# EAGLE design esp_garden_v2 (EAGLE 8.0.1)
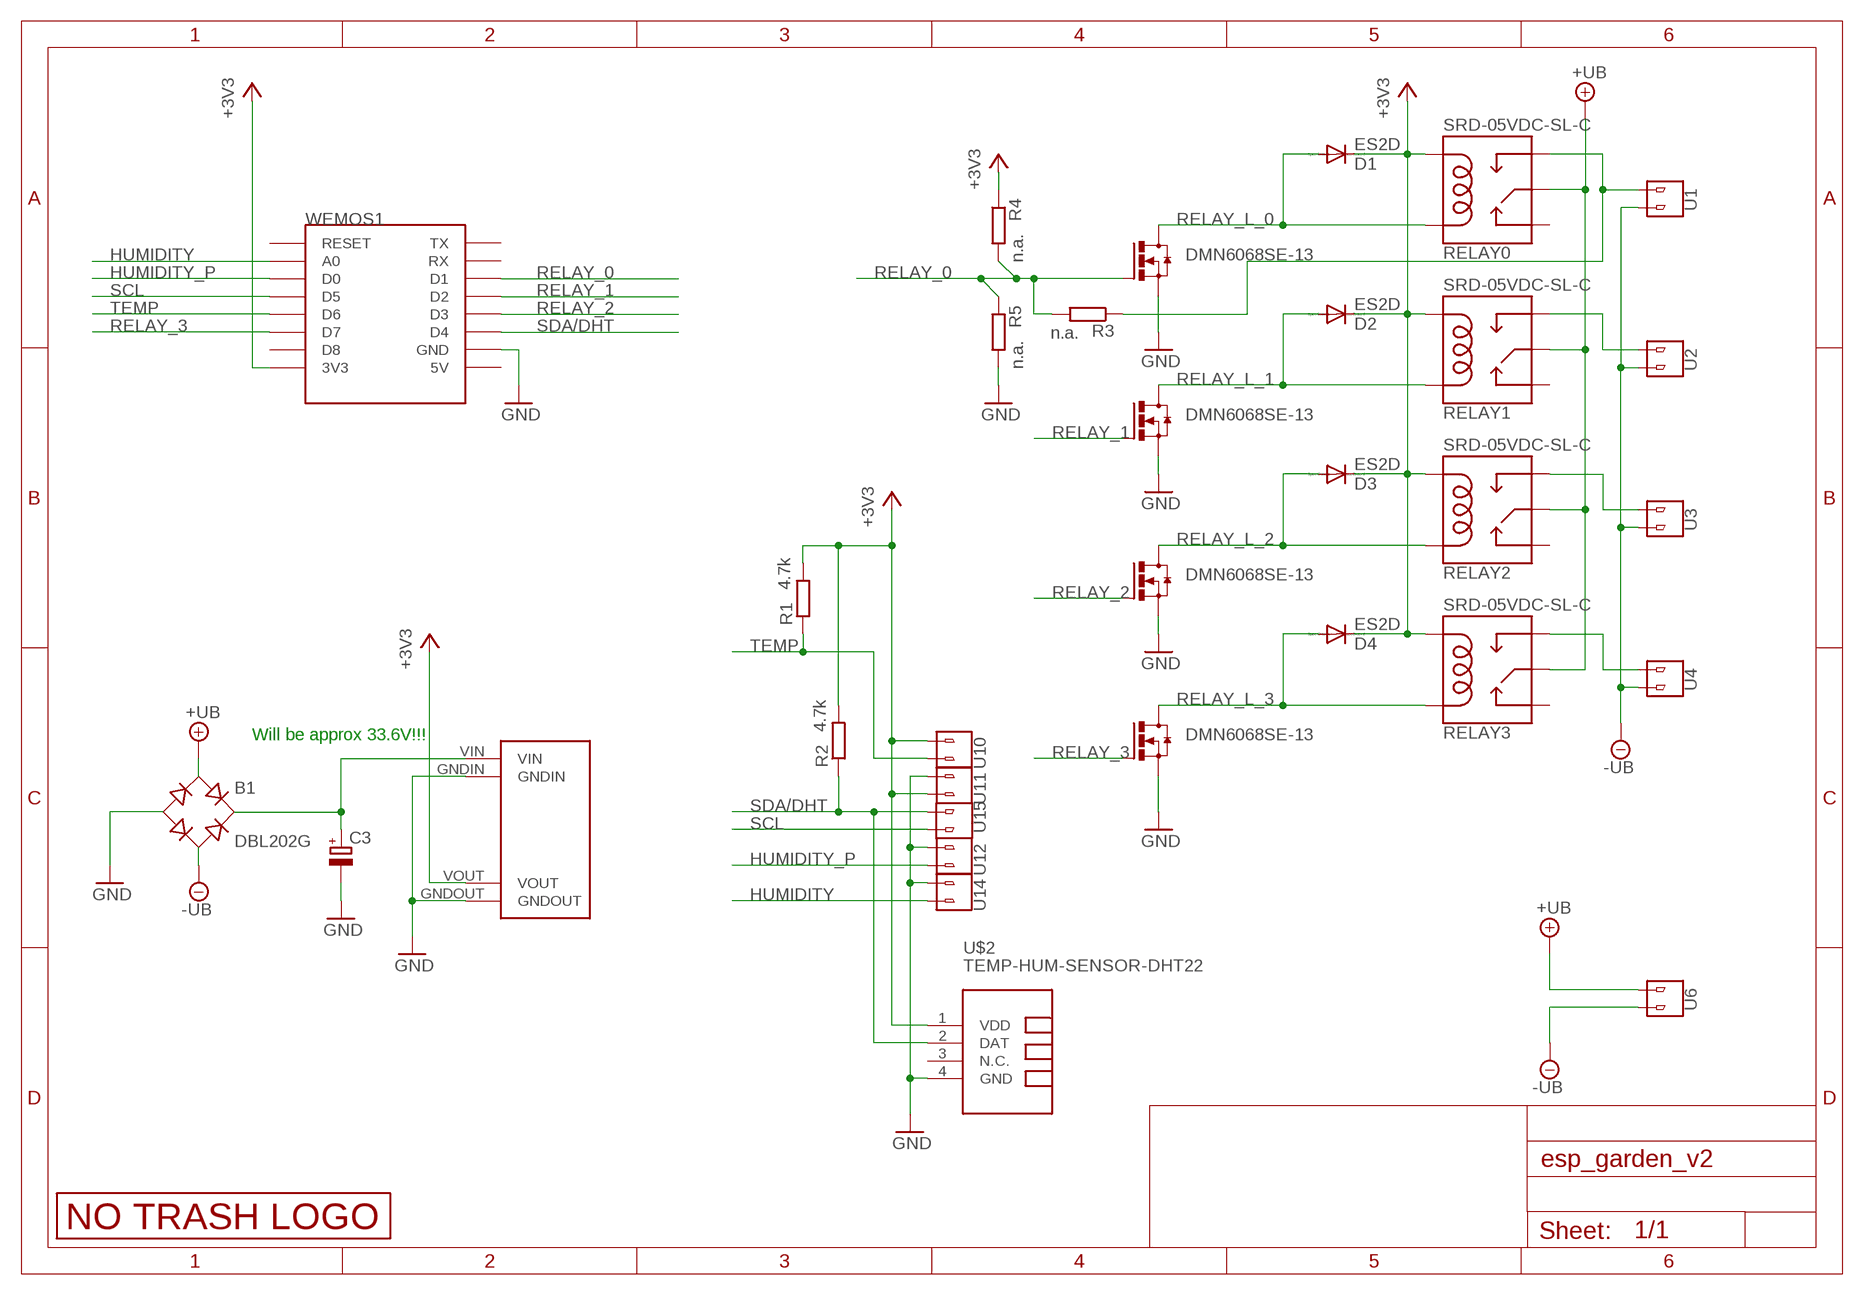
[diagram p0: schematic, sheet 1]

## Parts
B1  DBL202G  [DB]
C3  CPOL-EU150CLZ-0810  [150CLZ-0810]
D1  ES2D  DIODE-SMB  [SMB]
D2  ES2D  DIODE-SMB  [SMB]
D3  ES2D  DIODE-SMB  [SMB]
D4  ES2D  DIODE-SMB  [SMB]
R1  4.7k  R-EU_M0805  [M0805]
R2  4.7k  R-EU_M0805  [M0805]
R3  n.a.  R-EU_M0805  [M0805]
R4  n.a.  R-EU_M0805  [M0805]
R5  n.a.  R-EU_M0805  [M0805]
RELAY0  SRD-05VDC-SL-C  RELAYPTH  [SRD-05VDC-SL-C]
RELAY1  SRD-05VDC-SL-C  RELAYPTH  [SRD-05VDC-SL-C]
RELAY2  SRD-05VDC-SL-C  RELAYPTH  [SRD-05VDC-SL-C]
RELAY3  SRD-05VDC-SL-C  RELAYPTH  [SRD-05VDC-SL-C]
T1  DMN6068SE-13  NMOSFET_SMD_223  [SOT223]
T2  DMN6068SE-13  NMOSFET_SMD_223  [SOT223]
T3  DMN6068SE-13  NMOSFET_SMD_223  [SOT223]
T4  DMN6068SE-13  NMOSFET_SMD_223  [SOT223]
U1  V1  2_PIN_CONNECTOR  [2_SCREW_PIN]
U2  V1  2_PIN_CONNECTOR  [2_SCREW_PIN]
U3  V1  2_PIN_CONNECTOR  [2_SCREW_PIN]
U4  V1  2_PIN_CONNECTOR  [2_SCREW_PIN]
U6  V1  2_PIN_CONNECTOR  [2_SCREW_PIN]
U10  V1  2_PIN_CONNECTOR  [2_SCREW_PIN]
U11  V1  2_PIN_CONNECTOR  [2_SCREW_PIN]
U12  V1  2_PIN_CONNECTOR  [2_SCREW_PIN]
U14  V1  2_PIN_CONNECTOR  [2_SCREW_PIN]
U15  V1  2_PIN_CONNECTOR  [2_SCREW_PIN]
U$1  LOGO_NO_TRASHNO_TRASH  [LOGO_ROHS_NO_TRASH]
U$2  TEMP-HUM-SENSOR-DHT22  [TEMP-HUM-SENSOR-DHT22]
U$3  MP1584EN  [MP1584EN]
WEMOS1  WEMOS-D1-MINI  [WEMOS-D1-MINI]

## Nets
+3V3: D1.C D2.C D3.C D4.C R1.2 R2.2 R4.1 RELAY0.COIL0 RELAY1.COIL0 RELAY2.COIL0 RELAY3.COIL0 U10.P$2 U11.P$1 U$2.1(VDD) U$3.VOUT WEMOS1.3V3
+UB: B1.AC1 RELAY0.SWCOMMON RELAY1.SWCOMMON RELAY2.SWCOMMON RELAY3.SWCOMMON U6.P$1
-UB: B1.AC2 U1.P$2 U2.P$2 U3.P$2 U4.P$2 U6.P$2
GND: B1.- C3.- R5.2 T1.3(S) T2.3(S) T3.3(S) T4.3(S) U11.P$2 U12.P$2 U14.P$2 U$2.4(GND) U$3.GNDIN U$3.GNDOUT WEMOS1.GND
HUMIDITY: U14.P$1 WEMOS1.A0
HUMIDITY_P: U12.P$1 WEMOS1.D0
N$2: B1.+ C3.+ U$3.VIN
N$4: R3.1 RELAY0.SWOPEN U1.P$1
N$6: RELAY1.SWOPEN U2.P$1
N$7: RELAY2.SWOPEN U3.P$1
N$8: RELAY3.SWOPEN U4.P$1
RELAY_0: R3.2 R4.2 R5.1 T1.1(G) WEMOS1.D1
RELAY_1: T2.1(G) WEMOS1.D2
RELAY_2: T3.1(G) WEMOS1.D3
RELAY_3: T4.1(G) WEMOS1.D7
RELAY_L_0: D1.A RELAY0.COIL1 T1.2(D) T1.4(D)
RELAY_L_1: D2.A RELAY1.COIL1 T2.2(D) T2.4(D)
RELAY_L_2: D3.A RELAY2.COIL1 T3.2(D) T3.4(D)
RELAY_L_3: D4.A RELAY3.COIL1 T4.2(D) T4.4(D)
SCL: U15.P$2 WEMOS1.D5
SDA/DHT: R2.1 U15.P$1 U$2.2(DAT) WEMOS1.D4
TEMP: R1.1 U10.P$1 WEMOS1.D6
Unconnected: RELAY0.SWCLOSED(SWCLOSE) RELAY1.SWCLOSED(SWCLOSE) RELAY2.SWCLOSED(SWCLOSE) RELAY3.SWCLOSED(SWCLOSE) U$2.3(N.C.) WEMOS1.5V WEMOS1.D8 WEMOS1.RESET WEMOS1.RX WEMOS1.TX

## Notes on the sheet
- Will be approx 33.6V!!!

## Library data of the parts
B1 = rectifier:DB?*G: Single Phase 1.0 AMP Glass Passivated Bridge Rectifier Taiwan Semiconductor Co.,Ltd. - TSC Source: http://www.taiwansemi.com/TSCbig5/ezcatfiles/cust/img/img/db101g.pdf http://www.ts.com.tw/db/pictures/modules/PDT/PDT060207001/DBLS201G.pdf
C3 = rcl:CPOL-EU: POLARIZED CAPACITOR, European symbol
D1-D4 = diode:DIODE-: DIODE
R1-R5 = rcl:R-EU_: RESISTOR, European symbol
RELAY0 RELAY1-RELAY3 = JKW_CHIP:RELAY: SPDT relay (COM-00101)
T1-T4 = transistor-power:NMOSFET_SMD_223
U1-U4 U6 U10-U12 U14 U15 = JKW_CHIP:2_PIN_CONNECTOR
U$1 = JKW_CHIP:LOGO_NO_TRASH
U$2 = diy-modules:TEMP-HUM-SENSOR-DHT22: DHT22 - digital humidity & temperature sensor Also known as: AM2302 AM2302 datasheet available here: http://akizukidenshi.com/download/ds/aosong/AM2302.pdf Click here to find device on ebay.com <http://www.ebay.com/sch/dht22+digital+sensor>
U$3 = JKW_CHIP:MP1584EN
WEMOS1 = esp8266modules:WEMOS-D1-MINI: WeMos.cc D1 mini ESP8266 module

## Board
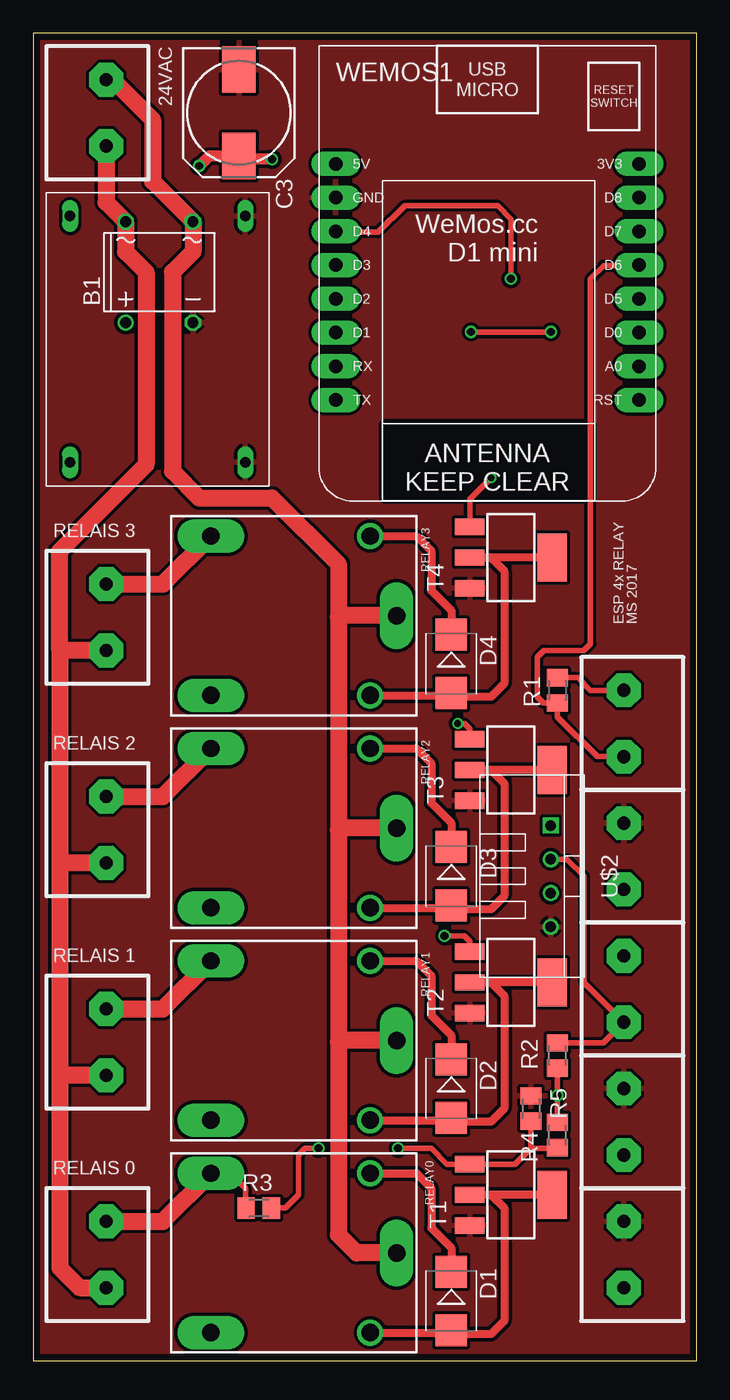
[diagram p1: board, top side]
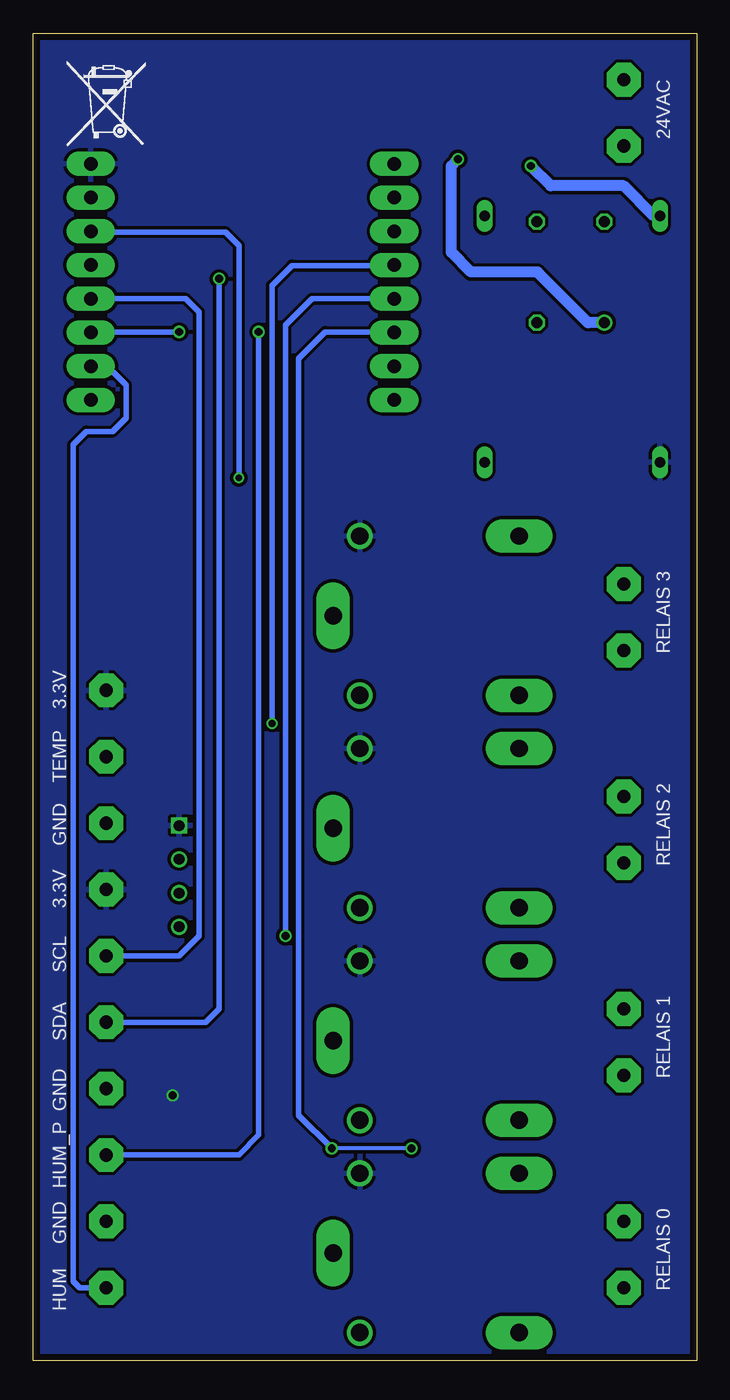
[diagram p2: board, bottom side, seen from below]

Size 50 x 100 mm. Coordinates in mm from the lower left corner, seen from the top.
Outline: 0,0 50,0 50,100 0,100 0,0
Copper layers (1*16): Top 0.035mm / dielectric 1.6mm / Bottom 0.035mm
Design rules "Elecrow_2-layer_PCB_eagle_rule": minimum track width 6mil, minimum drill 12mil, track to track 6mil, track to pad 6mil, pad to pad 6mil, via to via 8mil, smd to smd 0mil, copper to edge 20mil, drill to drill 10mil, minimum pad ring 6mil, minimum via ring 6mil, stop-mask expansion 0mil, vias tented up to drill 100mil, thermal gap 10mil
tRestrict: area 26.5,65 to 42,70.5

### Footprints (pad centres in the part's own frame; a part is rotated, then mirrored left to right if it is on the bottom)
DB = drill 0.813: + -2.54,-3.81 | drill 0.813 octagon: - 2.54,-3.81; AC1 2.54,3.81; AC2 -2.54,3.81
150CLZ-0810 = smd 3.5 x 2.5: + 3.25,0; - -3.25,0
SMB = smd 2.4 x 2.4: A 2.2,0; C -2.2,0
M0805 = smd 1.3 x 1.6: 1 -0.95,0; 2 0.95,0
SRD-05VDC-SL-C = drill 1.3: COIL0 -5.39,-6.12; COIL1 -5.39,5.88 | drill 1.3 pad 2.54 long: SWCLOSED 6.61,5.88; SWCOMMON -7.39,-0.12; SWOPEN 6.61,-6.12
SOT223 = smd 1.219 x 2.235: 1 -2.311,-3.099; 2 0,-3.099; 3 2.311,-3.099 | smd 3.6 x 2.2: 4 0,3.099
2_SCREW_PIN = drill 1 pad 2.54 octagon: P$1 -2.5,0.5; P$2 2.5,0.5
TEMP-HUM-SENSOR-DHT22 = drill 0.8 square: 1 -3.81,0 | drill 0.8: 2 -1.27,0; 3 1.27,0; 4 3.81,0
MP1584EN = drill 0.8 long: GNDIN 1.778,14.986; GNDOUT 20.32,14.986; VIN 1.778,1.778; VOUT 20.32,1.778
WEMOS-D1-MINI = drill 1.016 pad 1.829 long: 3V3 -10.16,-10.16; 5V 12.7,-10.16; A0 -10.16,5.08; D0 -10.16,2.54; D1 12.7,2.54; D2 12.7,0; D3 12.7,-2.54; D4 12.7,-5.08; D5 -10.16,0; D6 -10.16,-2.54; D7 -10.16,-5.08; D8 -10.16,-7.62; GND 12.7,-7.62; RESET -10.16,7.62; RX 12.7,5.08; TX 12.7,7.62

### Placement (x,y rotation side)
B1  9.5,82 0 top
C3  15.5,94 270 top
D1  31.5,4.5 270 top
D2  31.5,20.5 270 top
D3  31.5,36.5 270 top
D4  31.5,52.5 270 top
R1  39.5,50.5 90 top
R2  39.5,23 270 top
R3  17,11.5 0 top
R4  39.5,17 270 top
R5  37.5,19 90 top
RELAY0  20,8 180 top
RELAY1  20,24 180 top
RELAY2  20,40 180 top
RELAY3  20,56 180 top
T1  36,12.5 270 top
T2  36,28.5 270 top
T3  36,44.5 270 top
T4  36,60.5 270 top
U1  5,8 270 top
U2  5,24 270 top
U3  5,40 270 top
U4  5,56 270 top
U6  5,94 270 top
U10  45,48 90 top
U11  45,38 90 top
U12  45,18 90 top
U14  45,8 90 top
U15  45,28 90 top
U$1  47.5,91.5 0 bottom
U$2  39,36.5 270 top
U$3  1,88 270 top
WEMOS1  35.5,80 180 top

### Tracks (layer width: path | path; a pad name or v marks a point on that pad's centre or on a via)
+3V3  (via drill 0.6)
  Top 0.406: R1.2 41.05,51.45 42,50.5 U10.P$2 | R2.2 v39.5,20 R4.1
  Top 0.61: RELAY0.COIL0 28.88,14.12 30,13 30,10 31.5,8.5 D1.C | RELAY1.COIL0 28.88,30.12 30,29 30,26 31.5,24.5 D2.C | RELAY2.COIL0 28.88,46.12 30,45 30,42 31.5,40.5 D3.C | RELAY3.COIL0 28.88,62.12 30,61 30,58 31.5,56.5 D4.C
  pour Bottom (isolate 0.254): 49.5,0.5 0.5,0.5 0.5,99.5 49.5,99.5
+UB
  Top 1.27: U6.P$1 6,96.5 9,93.5 9,88.85 B1.AC1 12.04,83.54 10.5,82 10.5,67 12.5,65 18,65 23,60 23,56 | RELAY0.SWCOMMON 24.38,8.12 23,9.5 23,24 | 23,40 23,24 | 23,56 23,40 | RELAY1.SWCOMMON 23.12,24.12 23,24 | RELAY2.SWCOMMON 23.12,40.12 23,40 | RELAY3.SWCOMMON 23.12,56.12 23,56
-UB
  Top 1.27: U6.P$2 5.5,87.27 B1.AC2 6.96,83.54 8.5,82 8.5,67.5 2,61 2,53.5 | 2,37.5 2,21.5 | 2,53.5 2,37.5 | 2,21.5 2,7 3.5,5.5 U1.P$2 | U2.P$2 2,21.5 | U3.P$2 2,37.5 | U4.P$2 2,53.5
GND
  pour Top (isolate 0.254): 0.5,99.5 49.5,99.5 49.5,0.5 0.5,0.5
HUMIDITY
  Bottom 0.406: U14.P$1 46.5,5.5 47,6 47,69 46,70 44,70 43,71 43,73.5 44.5,75 45.58,75 WEMOS1.A0
HUMIDITY_P  (via drill 0.6)
  Top 0.406: v33,77.5 v39,77.5
  Bottom 0.406: U12.P$1 34.5,15.5 33,17 v33,77.5 | v39,77.5 45.62,77.5 WEMOS1.D0
N$2  (via drill 0.6)
  Top 0.813: v12.5,90 13.25,90.75 C3.+ 15.75,90.5 v18,90.5
  Bottom 0.813: U$3.VIN 3.22,86.22 5.5,88.5 11,88.5 v12.5,90 | B1.+ 8.19,78.19 10,80 12,82 17,82 18.5,83.5 18.5,90 v18,90.5
N$4
  Top 0.305: 16,11.55 R3.1
  Top 0.406: RELAY0.SWOPEN 14.88,14.12 16,13 16,11.55
  Top 1.27: U1.P$1 9.77,10.5 RELAY0.SWOPEN
N$6
  Top 1.27: U2.P$1 9.77,26.5 RELAY1.SWOPEN
N$7
  Top 1.27: U3.P$1 9.77,42.5 RELAY2.SWOPEN
N$8
  Top 1.27: U4.P$1 9.77,58.5 RELAY3.SWOPEN
RELAY_0  (via drill 0.6)
  Top 0.406: R3.2 19,11.5 20,12.5 20,15.5 20.5,16 v21.5,16 | v27.5,16 30,16 31.19,14.81 T1.1 36.31,14.81 37.5,16 | 37.5,16 R5.1 | 37.5,16 39.45,16 R4.2
  Bottom 0.305: v21.5,16 v27.5,16
  Bottom 0.406: v27.5,16 30,18.5 30,75.5 28,77.5 22.84,77.5 WEMOS1.D1
RELAY_1  (via drill 0.6)
  Top 0.406: v31,32 32.5,32 32.9,31.6 T2.1
  Bottom 0.406: v31,32 31,78 29,80 WEMOS1.D2
RELAY_2  (via drill 0.5)
  Top 0.406: T3.1 32.9,47.6 32.5,48 v32,48
  Bottom 0.406: v32,48 32,81 30.5,82.5 22.84,82.5 WEMOS1.D3
RELAY_3  (via drill 0.5)
  Top 0.406: 33.19,62.81 T4.1 32.9,64.9 v34.5,66.5
  Bottom 0.406: WEMOS1.D7 45.58,85 35.5,85 34.5,84 v34.5,66.5
RELAY_L_0
  Top 0.406: 31.5,2.12 D1.A 31.8,2 | T1.2 33.5,12.5 34.5,12.5
  Top 0.61: RELAY0.COIL1 31.5,2.12 | 34.5,12.5 35.5,11.5 35.5,3 34.5,2 31.8,2 | T1.4 33.5,12.5
RELAY_L_1
  Top 0.61: RELAY1.COIL1 31.32,18.12 D2.A 31.8,18 34.5,18 35.5,19 35.5,27.5 34.5,28.5 33.5,28.5 | 33.5,28.5 T2.2 | T2.4 33.5,28.5
RELAY_L_2
  Top 0.61: RELAY2.COIL1 31.32,34.12 D3.A 31.8,34 34.5,34 35.5,35 35.5,43.5 34.5,44.5 33.5,44.5 | 33.5,44.5 T3.2 | T3.4 33.5,44.5
RELAY_L_3
  Top 0.61: RELAY3.COIL1 31.32,50.12 D4.A 31.8,50 34.5,50 35.5,51 35.5,59.5 34.5,60.5 33.5,60.5 | 33.5,60.5 T4.2 | T4.4 33.5,60.5
  Bottom 0.61: 25.39,50.81 RELAY3.COIL1
SCL
  Bottom 0.406: U15.P$2 39,30.5 37.5,32 37.5,79 38.5,80 WEMOS1.D5
SDA/DHT  (via drill 0.6)
  Top 0.406: v36,81.5 36,86 35,87 28,87 26,85 22.88,85 WEMOS1.D4 | U$2.2 40.23,37.77 41.5,36.5 41.5,28.5 U15.P$1 42.95,23.95 R2.1
  Bottom 0.406: U15.P$1 37,25.5 36,26.5 v36,81.5
TEMP
  Top 0.406: U10.P$1 42.5,45.5 39.5,48.5 39.5,49.5 38.45,49.55 | 38.45,49.55 38,50 38,53 38.5,53.5 41.5,53.5 42,54 42,81.5 43,82.5 45.62,82.5 WEMOS1.D6 | R1.1 38.45,49.55

### Text on the board
tNames: 24VAC | RELAIS 3 | ESP 4x RELAY | MS 2017 | RELAIS 2 | RELAIS 1 | RELAIS 0
bNames: 24VAC | RELAIS 3 | 3.3V | TEMP | RELAIS 2 | GND | 3.3V | SCL | RELAIS 1 | SDA | GND | HUM_P | RELAIS 0 | GND | HUM